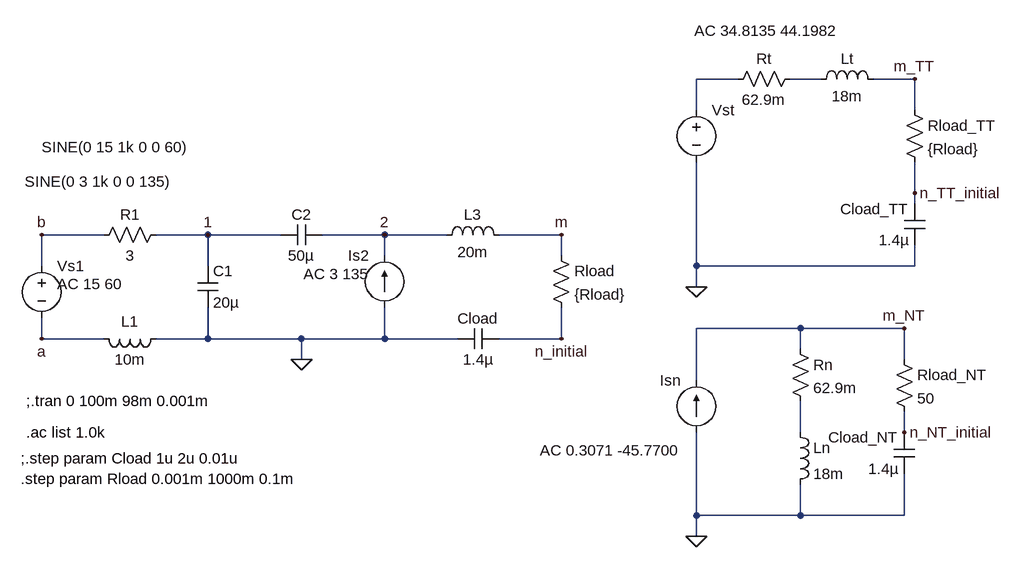
[diagram p0: schematic RTR806_Class_16_20231116_Investigation_of_Thevenins_Nortons_and_powers.asc]
RTR806_Class_16_20231116_Investigation_of_Thevenins_Nortons_and_powers.asc, the LTspice schematic file:
Version 4
SHEET 1 1524 680
WIRE 1120 -176 1056 -176
WIRE 1248 -176 1200 -176
WIRE 1392 -176 1328 -176
WIRE 1056 -128 1056 -176
WIRE 1392 -128 1392 -176
WIRE 1392 0 1392 -48
WIRE 1392 16 1392 0
WIRE 144 64 48 64
WIRE 304 64 224 64
WIRE 416 64 304 64
WIRE 576 64 480 64
WIRE 672 64 576 64
WIRE 848 64 752 64
WIRE 576 96 576 64
WIRE 848 96 848 64
WIRE 48 112 48 64
WIRE 304 112 304 64
WIRE 1056 112 1056 -48
WIRE 1392 112 1392 80
WIRE 1392 112 1056 112
WIRE 1056 144 1056 112
WIRE 1216 208 1056 208
WIRE 1376 208 1216 208
WIRE 48 224 48 192
WIRE 144 224 48 224
WIRE 304 224 304 176
WIRE 304 224 224 224
WIRE 448 224 304 224
WIRE 576 224 576 176
WIRE 576 224 448 224
WIRE 688 224 576 224
WIRE 848 224 848 176
WIRE 848 224 752 224
WIRE 1216 240 1216 208
WIRE 448 256 448 224
WIRE 1376 256 1376 208
WIRE 1056 288 1056 208
WIRE 1216 368 1216 320
WIRE 1376 368 1376 336
WIRE 1056 496 1056 368
WIRE 1216 496 1216 448
WIRE 1216 496 1056 496
WIRE 1376 496 1376 432
WIRE 1376 496 1216 496
WIRE 1056 528 1056 496
FLAG 448 256 0
FLAG 304 64 1
FLAG 576 64 2
FLAG 848 64 m
FLAG 48 224 a
FLAG 48 64 b
FLAG 1056 144 0
FLAG 1056 528 0
FLAG 1392 -176 m_TT
FLAG 1376 208 m_NT
FLAG 848 224 n_initial
FLAG 1392 0 n_TT_initial
FLAG 1376 368 n_NT_initial
SYMBOL voltage 48 96 R0
WINDOW 3 0 -167 Left 2
WINDOW 123 24 44 Left 2
WINDOW 39 0 0 Left 0
SYMATTR Value SINE(0 15 1k 0 0 60)
SYMATTR Value2 AC 15 60
SYMATTR InstName Vs1
SYMBOL res 240 48 R90
WINDOW 0 0 56 VBottom 2
WINDOW 3 32 56 VTop 2
SYMATTR InstName R1
SYMATTR Value 3
SYMBOL cap 288 112 R0
SYMATTR InstName C1
SYMATTR Value 20µ
SYMBOL ind 240 208 R90
WINDOW 0 5 56 VBottom 2
WINDOW 3 32 56 VTop 2
SYMATTR InstName L1
SYMATTR Value 10m
SYMATTR SpiceLine Rser=0
SYMBOL cap 480 48 R90
WINDOW 0 0 32 VBottom 2
WINDOW 3 32 32 VTop 2
SYMATTR InstName C2
SYMATTR Value 50µ
SYMBOL current 576 176 R180
WINDOW 0 24 80 Left 2
WINDOW 3 328 194 Left 2
WINDOW 123 24 52 Left 2
WINDOW 39 0 0 Left 0
SYMATTR InstName Is2
SYMATTR Value SINE(0 3 1k 0 0 135)
SYMATTR Value2 AC 3 135
SYMBOL ind 656 80 R270
WINDOW 0 32 56 VTop 2
WINDOW 3 5 56 VBottom 2
SYMATTR InstName L3
SYMATTR Value 20m
SYMATTR SpiceLine Rser=0
SYMBOL res 832 80 R0
SYMATTR InstName Rload
SYMATTR Value {Rload}
SYMBOL voltage 1056 -144 R0
WINDOW 123 -3 -106 Left 2
WINDOW 39 0 0 Left 0
SYMATTR InstName Vst
SYMATTR Value ""
SYMATTR Value2 AC 34.8135 44.1982
SYMBOL res 1216 -192 R90
WINDOW 0 0 56 VBottom 2
WINDOW 3 32 56 VTop 2
SYMATTR InstName Rt
SYMATTR Value 62.9m
SYMBOL ind 1232 -160 R270
WINDOW 0 32 56 VTop 2
WINDOW 3 5 56 VBottom 2
SYMATTR InstName Lt
SYMATTR Value 18m
SYMATTR SpiceLine Rser=0
SYMBOL res 1376 -144 R0
SYMATTR InstName Rload_TT
SYMATTR Value {Rload}
SYMBOL current 1056 368 R180
WINDOW 0 24 80 Left 2
WINDOW 3 24 0 Left 2
WINDOW 123 24 -28 Left 2
WINDOW 39 0 0 Left 0
SYMATTR InstName Isn
SYMATTR Value ""
SYMATTR Value2 AC 0.3071 -45.7700
SYMBOL res 1200 224 R0
SYMATTR InstName Rn
SYMATTR Value 62.9m
SYMBOL ind 1200 352 R0
SYMATTR InstName Ln
SYMATTR Value 18m
SYMATTR SpiceLine Rser=0
SYMBOL res 1360 240 R0
SYMATTR InstName Rload_NT
SYMATTR Value 50
SYMBOL cap 752 208 R90
WINDOW 0 0 32 VBottom 2
WINDOW 3 32 32 VTop 2
SYMATTR InstName Cload
SYMATTR Value 1.4µ
SYMBOL cap 1392 432 R180
WINDOW 0 24 56 Left 2
WINDOW 3 24 8 Left 2
SYMATTR InstName Cload_NT
SYMATTR Value 1.4µ
SYMBOL cap 1408 80 R180
WINDOW 0 24 56 Left 2
WINDOW 3 24 8 Left 2
SYMATTR InstName Cload_TT
SYMATTR Value 1.4µ
TEXT 24 320 Left 2 !;.tran 0 100m 98m 0.001m
TEXT 24 368 Left 2 !.ac list 1.0k
TEXT 16 440 Left 2 !.step param Rload 0.001m 1000m 0.1m
TEXT 16 408 Left 2 !;.step param Cload 1u 2u 0.01u

The netlist it stands for:
* RTR806_Class_16_20231116_Investigation_of_Thevenins_Nortons_and_powers.asc
Vs1 b a SINE(0 15 1k 0 0 60) AC 15 60
R1 1 b 3
C1 1 0 20µ
L1 0 a 10m Rser=0
C2 2 1 50µ
Is2 0 2 SINE(0 3 1k 0 0 135) AC 3 135
L3 2 m 20m Rser=0
Rload m n_initial {Rload}
Vst N001 0 AC 34.8135 44.1982
Rt N002 N001 62.9m
Lt N002 m_TT 18m Rser=0
Rload_TT m_TT n_TT_initial {Rload}
Isn 0 m_NT AC 0.3071 -45.7700
Rn m_NT N003 62.9m
Ln N003 0 18m Rser=0
Rload_NT m_NT n_NT_initial 50
Cload n_initial 0 1.4µ
Cload_NT 0 n_NT_initial 1.4µ
Cload_TT 0 n_TT_initial 1.4µ
;.tran 0 100m 98m 0.001m
.ac list 1.0k
.step param Rload 0.001m 1000m 0.1m
;.step param Cload 1u 2u 0.01u
.backanno
.end